# Altium schematic sheet PowerPlan.SchDoc
size 420 x 297 mm; Project: robotShield; SheetNumberSPQ: 2; SheetTotalSPQ: 2; FileName: PowerPlan; Date: 1404/07/05; CheckedBy: ?; DrawnBy: MohammadReza Tabasian; Engineer: MohammadReza Tabasian; SheetNumber: 2; SheetTotal: 2
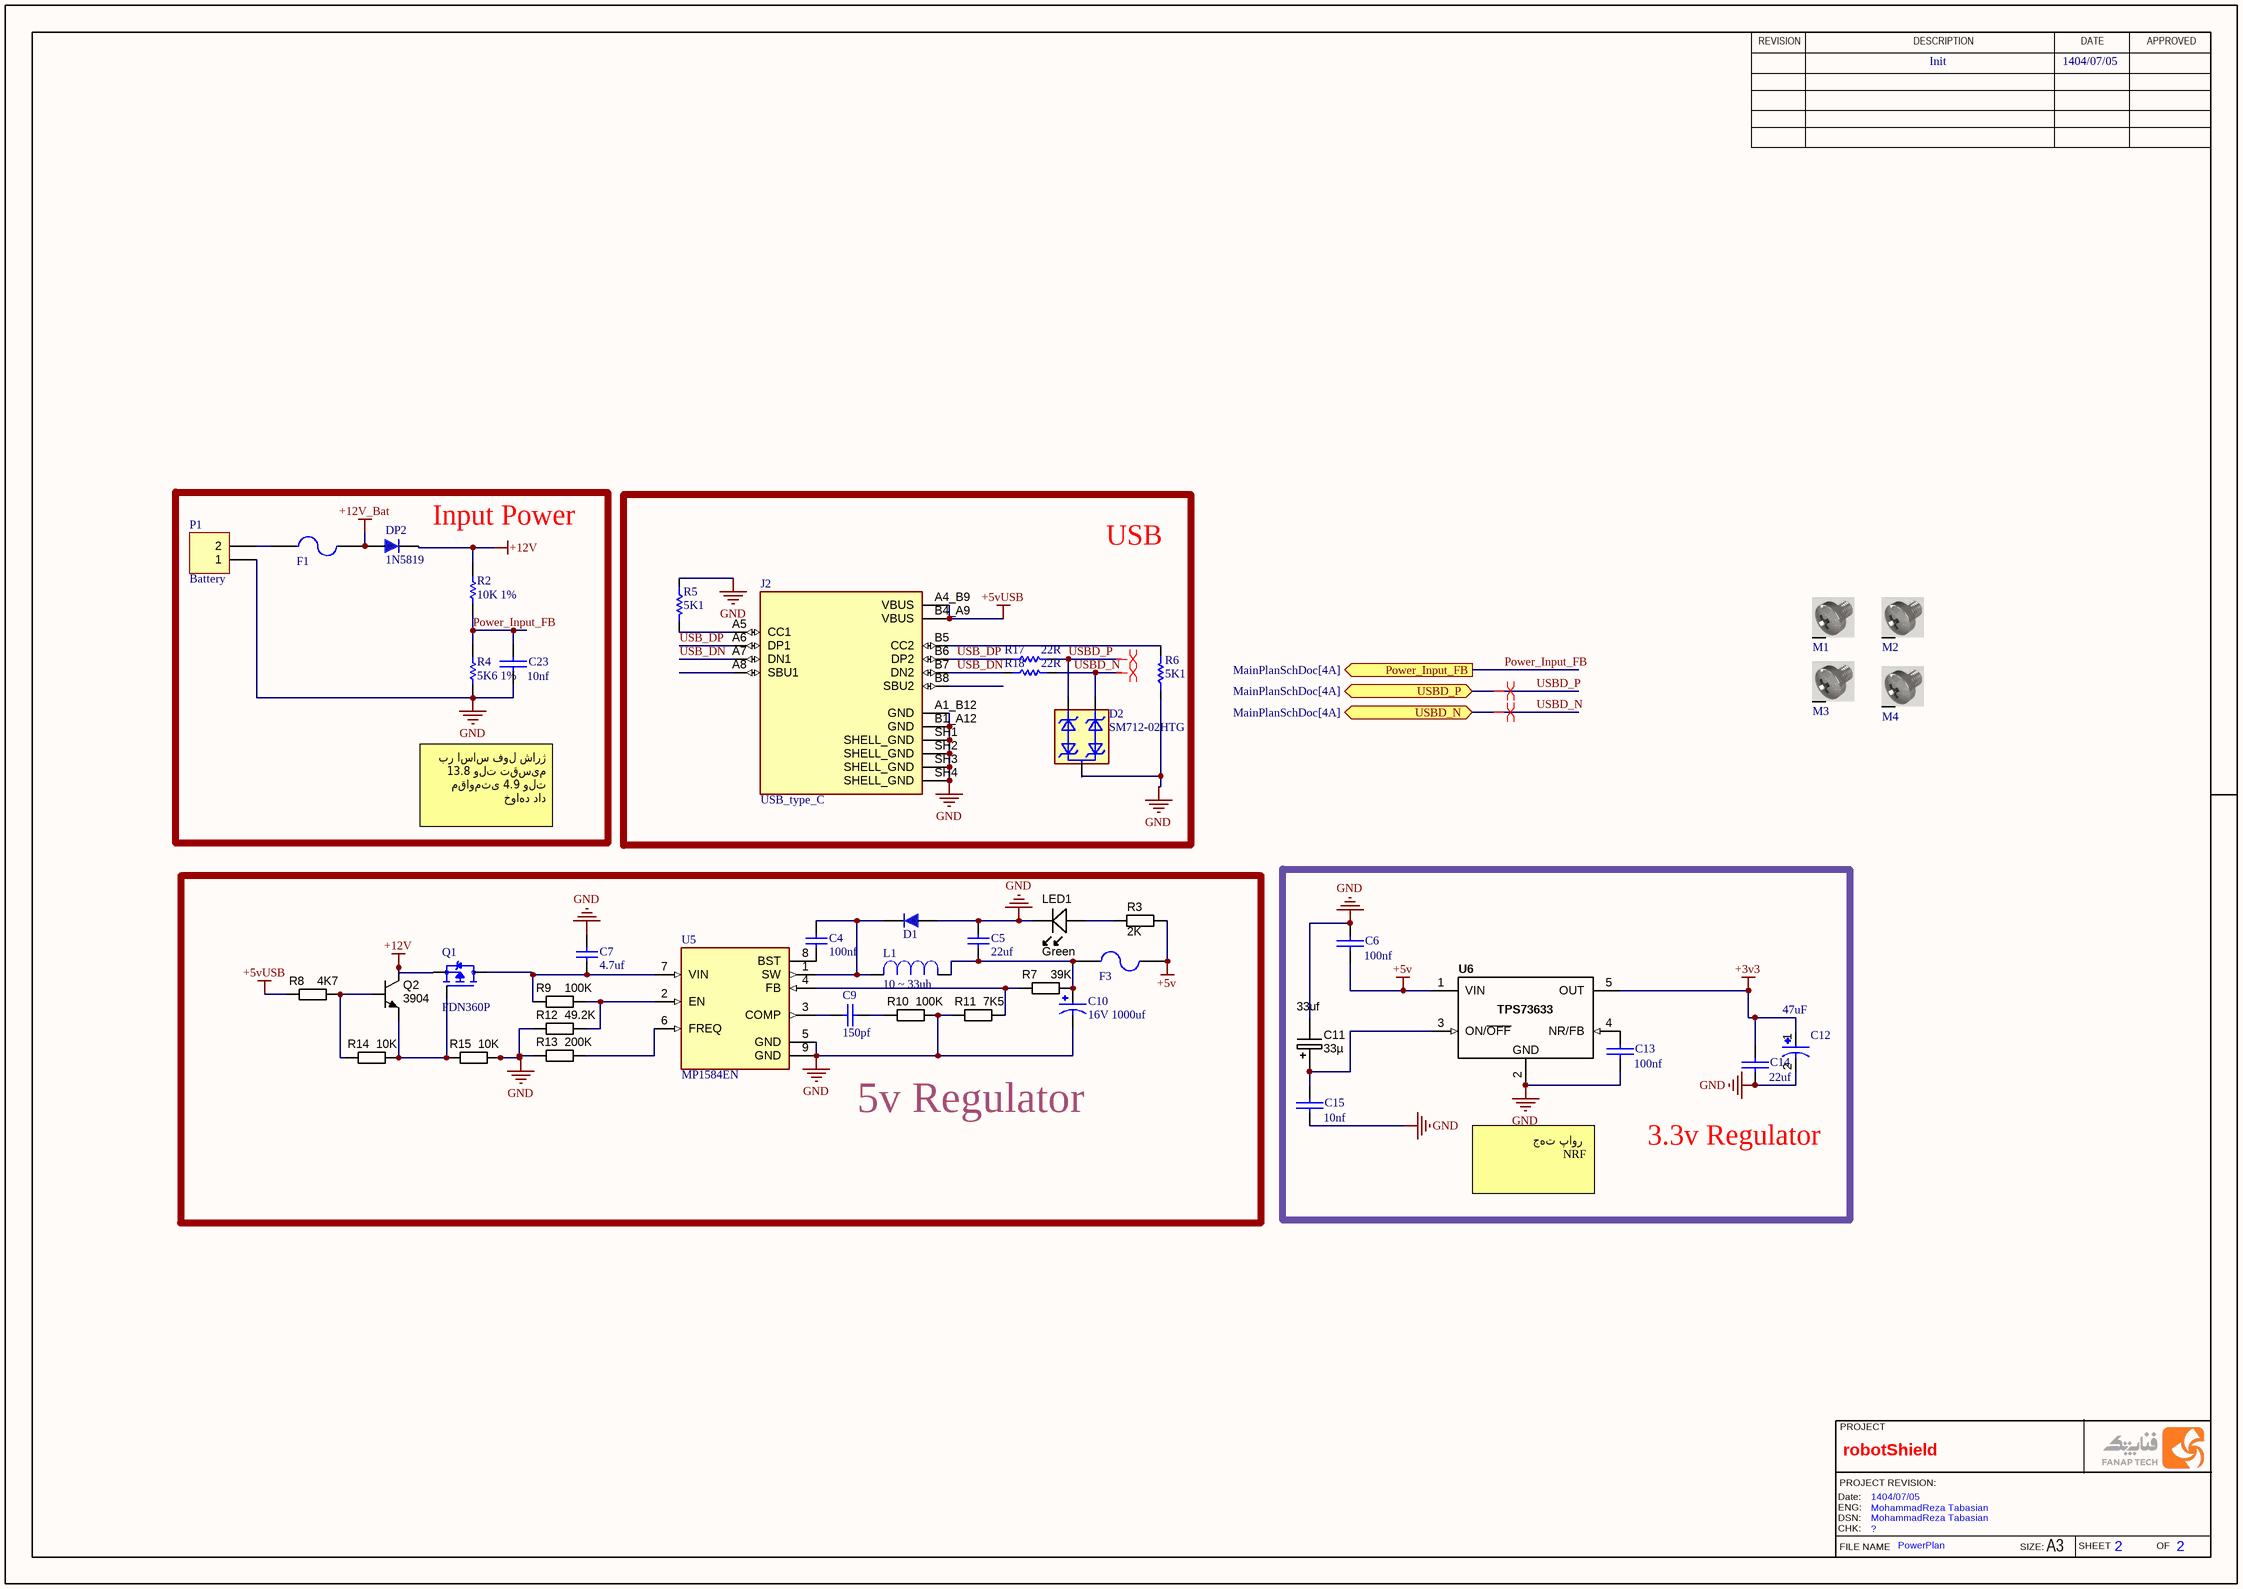
[diagram p0: PowerPlan.SchDoc]

## Parts
C4  100nf  [C0805]
C5  22uf  [C1206]
C6  100nf  [C0805]
C7  4.7uf  [C1206]
C9  150pf  [C0805]
C10  16V 1000uf  [CAP_SMD13*13]
C11  33uf  value 33µ  [CAPMP6032X280N]
C12  47uF  [CAPMP7343X430N]
C13  100nf  [C0805]
C14  22uf  [C1206]
C15  10nf  [C0805]
C23  10nf  [C0805]
D1  SS34  [DIOM4629X24N]  (value not drawn)
D2  SM712-02HTG  [SOT23]
DP2  1N5819  [430X270D]
F1  F300ma  [1206 FUSE]  (value not drawn)
F3  F300ma  [1206 FUSE]  (value not drawn)
J2  USB_type_C  [USB_type_C]
L1  10 ~ 33uh  [IND_7*7]
LED1  Color: Green  [LED-0805-K]  (hidden comment: LED)
M1  Screw  [Board Screw_No Silk]  (value not drawn)
M2  Screw  [Board Screw_No Silk]  (value not drawn)
M3  Screw  [Board Screw_No Silk]  (value not drawn)
M4  Screw  [Board Screw_No Silk]  (value not drawn)
P1  Battery  [HDR1X2]
Q1  FDN360P  [SOT95P251X112-3N]
Q2  3904  [SOT23-3]
R2  10K 1%  [C0805]
R3  2K  [C0805]
R4  5K6 1%  [C0805]
R5  5K1  [C0805]
R6  5K1  [C0805]
R7  39K  [C0805]
R8  4K7  [C0805]
R9  100K  [C0805]
R10  100K  [C0805]
R11  7K5  [C0805]
R12  49.2K  [C0805]
R13  200K  [C0805]
R14  10K  [C0805]
R15  10K  [C0805]
R17  22R  [C0805]
R18  22R  [C0805]
U5  MP1584EN  [SOIC_8P_127P600X170-9N]
U6  3.3V  [SOT23-5]  (value not drawn)

## Blocks framed on the sheet
Input Power: C23 DP2 F1 P1 R2 R4
USB: D2 J2 R5 R6 R17 R18
5v Regulator: C4 C5 C7 C9 C10 D1 F3 L1 LED1 Q1 Q2 R3 R7-R15 U5
3.3v Regulator: C6 C11-C15 U6

## Ports
Power_Input_FB (out, see MainPlanSchDoc[4A]), USBD_N (bidir, see MainPlanSchDoc[4A]), USBD_P (bidir, see MainPlanSchDoc[4A])

## Nets
+3v3: C12.1 C14.1(+) U6.5(OUT)
+5v: C6.2(-) F3.2 R3.1 U6.1(VIN)
+5vUSB: J2.A4_B9(VBUS) J2.B4_A9(VBUS) R8.1
+12V: DP2.2 Q1.2(S) Q2.3(C) R2.2
+12V_Bat: DP2.1 F1.2
GND: C5.1 C6.1(+) C7.2 C10.2 C11.2 C12.2 C13.2(-) C14.2(-) C15.2(-) C23.2(-) D1.1 D2.3 J2.A1_B12(GND) J2.B1_A12(GND) J2.SH1(SHELL_GND) J2.SH2(SHELL_GND) J2.SH3(SHELL_GND) J2.SH4(SHELL_GND) LED1.K P1.1 R4.1 R5.1 R6.1 R10.2 R11.1 R12.1 R13.1 R15.2 U5.5(GND) U5.9(GND) U6.2(GND)
Power_Input_FB: C23.1(+) R2.1 R4.2 ; port Power_Input_FB
USB_DN: J2.A7(DN1) J2.B7(DN2) R18.1
USB_DP: J2.A6(DP1) J2.B6(DP2) R17.1
USBD_N: D2.1 R18.2 ; port USBD_N
USBD_P: D2.2 R17.2 ; port USBD_P
NetC4_1: C4.1 D1.2 L1.2 U5.1(SW)
NetC4_2: C4.2 U5.8(BST)
NetC5_2: C5.2 C10.1 F3.1 L1.1 R7.2
NetC7_1: C7.1 Q1.3(D) R9.1 U5.7(VIN)
NetC9_1: C9.1 R10.1
NetC9_2: C9.2 U5.3(COMP)
NetC11_1: C11.1 C15.1(+) U6.3(ON/~{OFF})
NetC13_1: C13.1(+) U6.4(NR/FB)
NetF1_1: F1.1 P1.2
NetJ2_A5: J2.A5(CC1) R5.2
NetJ2_B5: J2.B5(CC2) R6.2
NetLED1_A: LED1.A R3.2
NetQ1_1: Q1.1(G) Q2.2(E) R14.2 R15.1
NetQ2_1: Q2.1(B) R8.2 R14.1
NetR7_1: R7.1 R11.2 U5.4(FB)
NetR9_2: R9.2 R12.2 U5.2(EN)
NetR13_2: R13.2 U5.6(FREQ)

Not connected (* = marked no-connect by the designer): J2 A8(SBU1) B8(SBU2); M1 S; M2 S; M3 S; M4 S

## Layout directives
differential pair: USBD_N, USBD_P

## Notes on the sheet
- Init
- 1404/07/05
- بر اساس فول شارژ 13.8 ولت تقسیم مقاومتی 4.9 ولت خواهد داد
- جهت پاور
  NRF
- REVISION
- DESCRIPTION
- DATE
- APPROVED
- PROJECT
- FILE NAME
- PROJECT REVISION:
- Date:
- ENG:
- DSN:
- CHK:
- SIZE:
- SHEET
- OF
- A3
- (in symbol LinREG_3V3_400mA_TPS73633DBV) TPS73633

## Library data of the parts
C4 C9 = CAP SMD 0805: CAP 0805; Designer: Abbas Basereh; Desc.: CAP SMD 0805; Data: 16-12-2016
C5 C7 = CAP SMD 1206: CAP 1206; Designer: Abbas Basereh; Desc.: CAP SMD 1206; Data: 16-12-2016
C6 C13-C15 C23 = Cap-Bipolar: Bipolar Capacitor; Voltage: 100V; Designer: Saeid Jorablo; Organazation: ControTec; Adding Date: 1387/12/20
C10 = CAP_SMD13*13: CAP ALUM 470UF 20% 35V SMD; MF: Panasonic Electronic Components; MP: EEE-FN1V471UP; Check_prices: https://www.snapeda.com/parts/EEE-FN1V471UP/Panasonic/view-part/6178317/?ref=eda; SnapEDA_Link: https://www.snapeda.com/parts/EEE-FN1V471UP/Panasonic/view-part/6178317/?ref=snap; Availability: In Stock; Package: RADIAL-2 Panasonic; Price: None; Value: *
C11 = CAPT_33u_3216_6V3: Capacitor SMD Tantalum 33uF 10% 6.3V 3216-18; Manufacturer 1: Kemet; Manufacturer Part Number 1: T491A336K006AT; Material: Solid Tantalum; SCDType: source; Package / Case: EIA 535BAAC size A; Ratings: 6.3V; Tolerance: ±10%; ComponentLink2URL: http://www.avx.com/docs/Catalogs/tcj.pdf; ComponentLink2Description: http://www.avx.com/docs/Catalogs/tcj.pdf; Supplier 1: Digi-Key; Supplier Part Number 1: 399-9716-1-ND; ComponentLink1URL: http://capacitoredge.kemet.com/capedge2/DataSheet?pn=T491A336K006AT; ComponentLink1Description: http://capacitoredge.kemet.com/capedge2/DataSheet?pn=T491A336K006AT; Supplier 2: Digi-Key; Supplier Part Number 2: 478-1666-1-ND; Manufacturer 2: AVX Corporation; Manufacturer Part Number 2: TAJA336K006RNJ; Manufacturer 4: Samsung Electro-Mechanics; Manufacturer Part Number 4: TCSCS0J336KAAR; ComponentLink4URL: http://components.arrow.com/partservice/dataview/altium/51540102S9917798N4139?apiKey=aa438727d59eed98c4bed826d8d949c84cb5e685b92bf87346a0226bd2658797; ComponentLink4Description: http://components.arrow.com/partservice/dataview/altium/51540102S9917798N4139?apiKey=aa438727d59eed98c4bed826d8d949c84cb5e685b92bf87346a0226bd2658797; Supplier 3: Digi-Key; Supplier Part Number 3: 293D336X96R3A2TE3-ND; Manufacturer Part Number 3: 293D336X96R3A2TE3; Manufacturer 3: Vishay Sprague; ComponentLink3URL: http://www.vishay.com/doc?40002; ComponentLink3Description: http://www.vishay.com/doc?40002; Supplier 4: Arrow; Supplier Part Number 4: 51540102S9917798N4139
C12 = T541X107M025AH6510: Cap, Tant, 470uf, 10v, Case x; MF: KEMET; Check_prices: https://www.snapeda.com/parts/T541X107M025AH6510/KEMET/view-part/?ref=eda; Purchase-URL: https://pricing.snapeda.com/search/part/T541X107M025AH6510/?ref=eda; Value: *; MP: T541X107M025AH6510; SnapEDA_Link: https://www.snapeda.com/parts/T541X107M025AH6510/KEMET/view-part/?ref=snap; Availability: In Stock; Price: None; Package: SMD-2 KEMET
D1 = 1n4007 SMD M7: Standard Rectifiers; Part. No: M7; Manufacturer: DC COMPONENTS; Designer: Abbas Basereh; Link: http://www.tme.eu/en/details/m7/smd-universal-diodes/dc-components/; Link: https://www.aliexpress.com/item/Smd-tube-1n4007-m7-SMA/1213719741.html?spm=2114.01010208.3.1.ZyZ7bC&ws_ab_test=searchweb0_0,searchweb201602_4_10065_10068_10084_10083_10080_10082_10081_10060_10061_10062_10056_10055_10054_10059_10099_10078_10079_427_10073_10103_10102_10096_10052_10050_10051,searchweb201603_4&btsid=db2be5ca-e560-400a-b91c-484ab5ee228b; Data: 16-12-2016
D2 = SM712-02HTG: TVS Diode, SM712 Series, 31V Clamp, 600W Peak Pulse, Surface Mount, SOT23-3 | Littelfuse SM712-02HTG; SnapEDA_Link: https://www.snapeda.com/parts/SM712-02HTG/Ersa/view-part/?ref=snap; Package: TO-236 Littelfuse; Value: *; MF: Littelfuse; MP: SM712-02HTG; Check_prices: https://www.snapeda.com/parts/SM712-02HTG/Ersa/view-part/?ref=eda
DP2 = 1N5819: Schottkey Rectifiers; Designer: Abbas Basereh; Data: 16-12-2016; Link: *; Part. No: *
F1 F3 = Fuse SMD1206: SMD Fuses 1206; Designer: Abbas Basereh; Desc.: SMD Fuses 1206; Data: 16-12-2016
J2 = USB_type_C: MF: {'manufacturer': u'GCT'}; MP: USB4105-GF-A; Package: None; Price: None; Value: *; Availability: Unavailable
L1 = Inductor 100uh: 100ÂµH Shielded Wirewound Inductor 1.96A 163mOhm Nonstandard; MF: Eaton; MP: DR127-101-R; Package: Nonstandard Eaton; Price: None; SnapEDA_Link: https://www.snapeda.com/parts/DR127-101-R/Eaton/view-part/2755655/?ref=snap; Value: *; Availability: Unavailable
LED1 = LED_SMD_Green_0805_6mcd: LED, 0805 SMD, Green; Manufacturer 1: LITE-ON; Manufacturer Part Number 1: LTST-C171GKT; Material: GaP; Ratings: 6 mcd; 569 nm; SCDType: source; Package / Case: 0805; Supplier 1: Digi-Key; Supplier Part Number 1: 160-1423-1-ND; Value: Green
M1-M4 = Board Screw: Board Screw With Spacer
P1 = Header 2: Header, 2-Pin; LatestRevisionDate: 17-Jul-2002; LatestRevisionNote: Re-released for DXP Platform.; Publisher: Altium Limited
Q1 = FDN360P: P-Channel 30V 2A (Ta) 500mW (Ta) Surface Mount SuperSOT-3; MF: ON; Value: *; Package: TO-236-3 ON; Check_prices: https://www.snapeda.com/parts/FDN360P/Onsemi/view-part/?ref=eda; Price: None; MP: FDN360P; Availability: In Stock; SnapEDA_Link: https://www.snapeda.com/parts/FDN360P/Onsemi/view-part/?ref=snap; Purchase-URL: https://pricing.snapeda.com/search/part/FDN360P/?ref=eda
Q2 = NPN_MMBT3904: Transistor SMD NPN 40V 0.2A 250mW SOT-23; Manufacturer 1: Fairchild Semiconductor; Ratings: 40V; 200mA; 250mW; Material: Si; SCDType: source; Package / Case: SOT-23; Supplier 1: Digi-Key; Supplier Part Number 1: MMBT3904FSCT-ND; Transistor Type: NPN; Mounting Type: Surface Mount; Supplier 2: Digi-Key; Supplier Part Number 2: 568-1741-1-ND; Manufacturer 2: NXP Semiconductors; Manufacturer Part Number 2: PMBT3904,215; ComponentLink2URL: http://www.nxp.com/documents/data_sheet/PMBT3904.pdf; ComponentLink2Description: http://www.nxp.com/documents/data_sheet/PMBT3904.pdf; ComponentLink1URL: http://www.fairchildsemi.com/ds/MM/MMBT3904.pdf; ComponentLink1Description: http://www.fairchildsemi.com/ds/MM/MMBT3904.pdf; Manufacturer Part Number 1: 3904
R2 R4 = RES 1206 0.25W: RES 1206; Designer: Abbas Basereh; Desc.: RES SMD 1206; Data: 16-12-2016
R3 R7-R15 = RES_0R_0805: Resistor SMD 0805; Manufacturer 1: Samsung Electro-Mechanics America, Inc; Manufacturer Part Number 1: RC2012J000CS; Ratings: 1/8W; SCDType: spec; Tolerance: N/A; Package / Case: 0805 (2012 metric); Supplier 1: Digi-Key; Supplier Part Number 1: 1276-5466-6-ND; RoHS 1: RoHS Compliant; ComponentLink1URL: http://www.samsungsem.com/servlet/FileDownload?filename=productcatalog/pdf/Chip_Resistor.pdf; ComponentLink1Description: http://www.samsungsem.com/servlet/FileDownload?filename=productcatalog/pdf/Chip_Resistor.pdf; Supplier 2: Digi-Key; Supplier Part Number 2: RMCF0805ZT0R00DKR-ND; Manufacturer 2: Stackpole Electronics Inc; Manufacturer Part Number 2: RMCF0805ZT0R00; RoHS 2: RoHS Compliant; ComponentLink2URL: http://www.seielect.com/Catalog/SEI-RMCF_RMCP.pdf; ComponentLink2Description: http://www.seielect.com/Catalog/SEI-RMCF_RMCP.pdf; Supplier 3: Digi-Key; Supplier Part Number 3: 311-0.0ARDKR-ND; Manufacturer 3: Yageo; Manufacturer Part Number 3: RC0805JR-070RL; RoHS 3: RoHS Compliant; ComponentLink3URL: http://media.digikey.com/pdf/Data%20Sheets/Yageo%20PDFs/RC0805%20Pb%20Free.pdf; ComponentLink3Description: http://media.digikey.com/pdf/Data%20Sheets/Yageo%20PDFs/RC0805%20Pb%20Free.pdf; Supplier 4: Digi-Key; Supplier Part Number 4: P0.0ADKR-ND; Manufacturer 4: Panasonic Electronic Components; Manufacturer Part Number 4: ERJ-6GEY0R00V; RoHS 4: RoHS Compliant; ComponentLink4URL: http://industrial.panasonic.com/www-cgi/jvcr13pz.cgi?E+PZ+3+AOA0001+ERJ6GEY0R00V+7+WW; ComponentLink4Description: http://industrial.panasonic.com/www-cgi/jvcr13pz.cgi?E+PZ+3+AOA0001+ERJ6GEY0R00V+7+WW; Supplier 5: Digi-Key; Supplier Part Number 5: RHM0.0CPDKR-ND; Manufacturer 5: Rohm Semiconductor; Manufacturer Part Number 5: MCR10ERTJ000; RoHS 5: RoHS Compliant; ComponentLink5URL: http://rohmfs.rohm.com/en/products/databook/datasheet/passive/resistor/chip_resistor/mcr_g.pdf; ComponentLink5Description: http://rohmfs.rohm.com/en/products/databook/datasheet/passive/resistor/chip_resistor/mcr_g.pdf
R5 R6 R17 R18 = Resistor
U5 = MP1584EN: Buck Switching Regulator IC Positive Adjustable 0.8V 1 Output 3A 8-SOIC _0.154, 3.90mm Width_ Exposed Pad; MF: Monolithic Power; MP: MP1584EN; Value: *; Package: SOIC-8 Monolithic Power; SnapEDA_Link: https://www.snapeda.com/parts/MP1584EN/Monolithic%20Power%20Systems%20Inc./view-part/891721/?ref=snap; Price: None; Availability: Unavailable
U6 = LinREG_3V3_400mA_TPS73633DBV: IC LDO Regulator 3.3V 400mA SOT23-5 SMD; Manufacturer 1: Texas Instruments; Manufacturer Part Number 1: TPS73633DBVT; Voltage Regulator Type: Switching Buck; Tolerance: ±0.5%; Ratings: 5.5Vin Max; Value: 3.3V; 400mA; Regulator Topology: Positive Fixed; Voltage - Input: 3.5V to 5.5V; Voltage - Dropout (Typical): 0.075V @ 400mA; Current - Output: 400mA (Max); SCDType: spec; Package / Case: SOT23-5; Supplier 1: Digi-Key; Supplier Part Number 1: 296-15819-1-ND; Voltage - Output: 3.3V; Current - Limit (Min): 400mA; ComponentLink1URL: http://www.ti.com/lit/ds/symlink/tps73601.pdf; ComponentLink1Description: http://www.ti.com/lit/ds/symlink/tps73601.pdf